# Altium schematic sheet Badge TAV.SchDoc
size A4
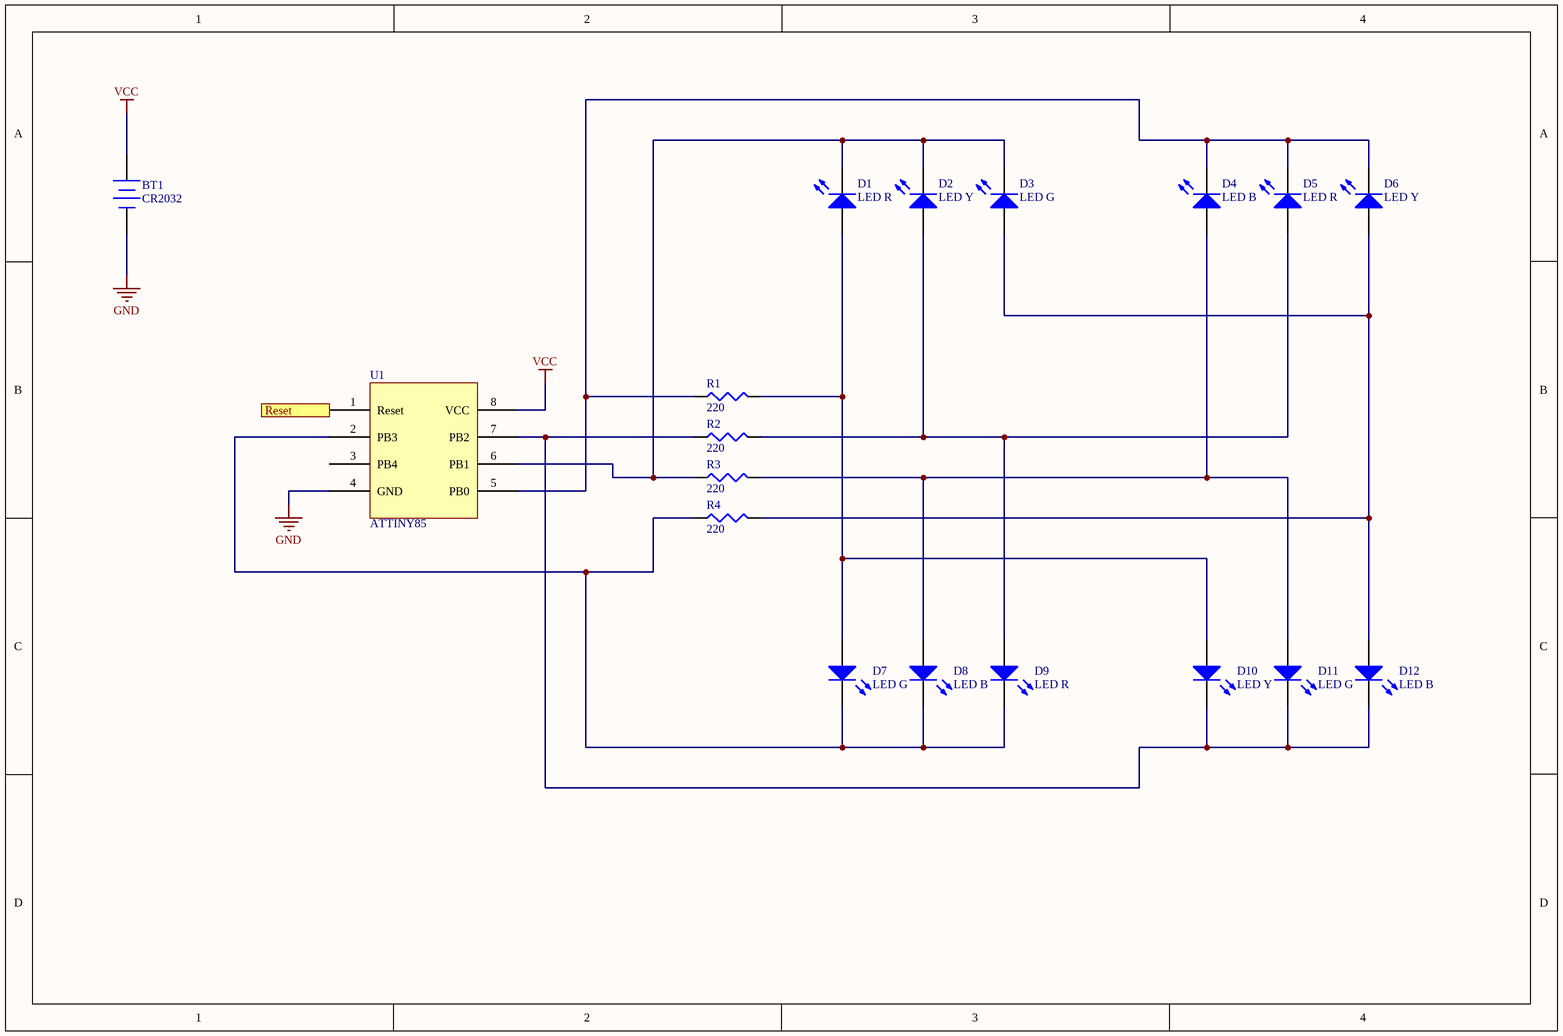
[diagram p0: Badge TAV.SchDoc]

## Parts
BT1  CR2032  [CR2032]
D1  LED R  [LED 3.5mm - Sense Símbol]
D2  LED Y  [LED 3.5mm - Sense Símbol]
D3  LED G  [LED 3.5mm - Sense Símbol]
D4  LED B  [LED 3.5mm - Sense Símbol]
D5  LED R  [LED 3.5mm - Sense Símbol]
D6  LED Y  [LED 3.5mm - Sense Símbol]
D7  LED G  [LED 3.5mm - Sense Símbol]
D8  LED B  [LED 3.5mm - Sense Símbol]
D9  LED R  [LED 3.5mm - Sense Símbol]
D10  LED Y  [LED 3.5mm - Sense Símbol]
D11  LED G  [LED 3.5mm - Sense Símbol]
D12  LED B  [LED 3.5mm - Sense Símbol]
R1  220  [AXIAL-0.4]
R2  220  [AXIAL-0.4]
R3  220  [AXIAL-0.4]
R4  220  [AXIAL-0.4]
U1  ATTINY85  [DIP8]

## Ports
Reset

## Nets
GND: BT1.2(-) U1.4(GND)
VCC: BT1.1(+) U1.8(VCC)
Reset: U1.1(Reset) ; port Reset
NetD1_1: D1.1(A) D7.1(A) D10.1(A) R1.2
NetD1_2: D1.2(K) D2.2(K) D3.2(K) R3.1 U1.6(PB1)
NetD2_1: D2.1(A) D5.1(A) D9.1(A) R2.2
NetD3_1: D3.1(A) D6.1(A) D12.1(A) R4.2
NetD4_1: D4.1(A) D8.1(A) D11.1(A) R3.2
NetD4_2: D4.2(K) D5.2(K) D6.2(K) R1.1 U1.5(PB0)
NetD7_2: D7.2(K) D8.2(K) D9.2(K) R4.1 U1.2(PB3)
NetD10_2: D10.2(K) D11.2(K) D12.2(K) R2.1 U1.7(PB2)

Not connected (* = marked no-connect by the designer): U1 3(PB4)

## Library data of the parts
BT1 = Battery: Multicell Battery; Marca: TE; Model: 796136-1; Preu: 1.57; Proveidor: TME; Referencia: 796136-1
D1 D5 D9 = LED0: Marca: Multicomp; Model: 703-0090; Preu: 0.21; Proveidor: Farnell; Referencia: 2112100
D2 D6 D10 = LED0: Marca: Multicomp; Model: 703-0088; Preu: 0.191; Proveidor: Farnell; Referencia: 2112098
D3 D7 D11 = LED0: Marca: Multicomp; Model: 703-0087; Preu: 0.164; Proveidor: Farnell; Referencia: 2112096
D4 D8 D12 = LED0: Marca: Broadcom; Model: HLMP-KA45-E0000; Preu: 0.445; Proveidor: Farnell; Referencia: 1863182
R1-R4 = Res3: Resistor; Marca: TE; Model: CPF-A-0603B220RE1; Preu: 0.169; Proveidor: Farnell; Referencia: 2483904
U1 = ATTINY85: Proveidor: Farnell; Referencia: 1455162; Marca: Microchip; Model: ATTINY85-20PU; Preu: 1.02